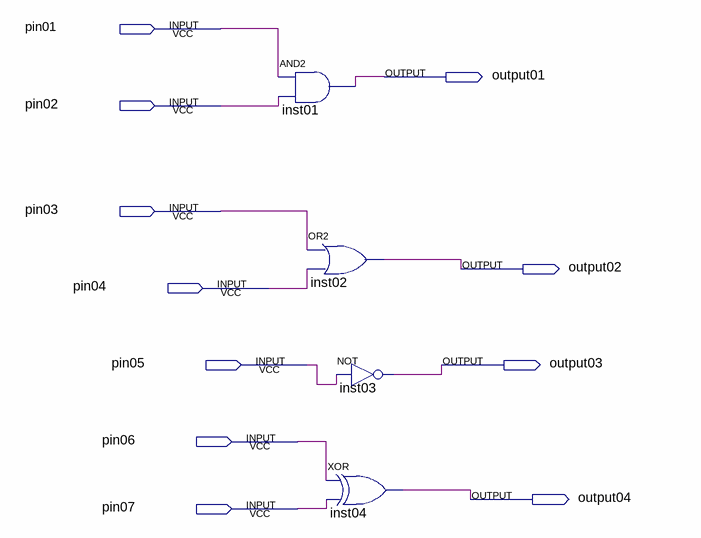
[diagram p0: schematic sheet]
// Quartus schematic ex01.bdf as structural Verilog: 4 symbols, 11 pins
module ex01 (
  input  pin01,
  input  pin02,
  input  pin03,
  input  pin04,
  input  pin05,
  input  pin06,
  input  pin07,
  output output01,
  output output02,
  output output03,
  output output04
);

  and inst01 (output01, pin01, pin02);
  or inst02 (output02, pin03, pin04);
  not inst03 (output03, pin05);
  xor inst04 (output04, pin06, pin07);
endmodule
